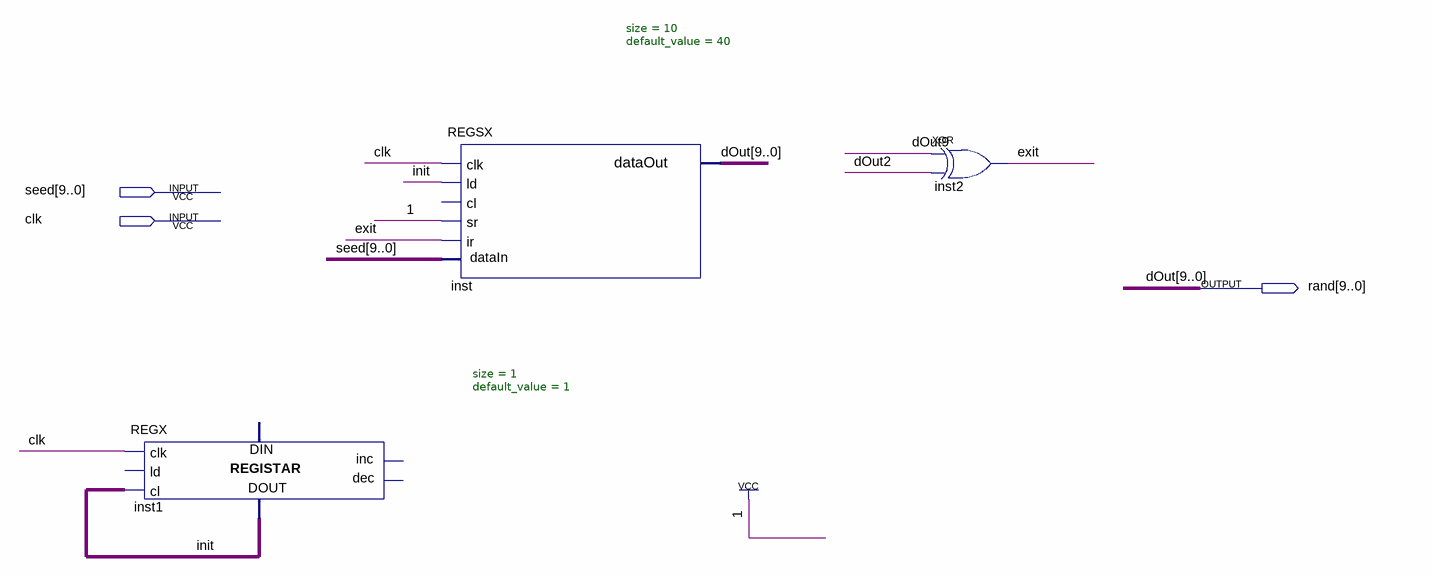
[diagram p0: schematic sheet]
// Quartus schematic randomNumberGenerator.bdf as structural Verilog: 3 symbols, 3 pins
module randomNumberGenerator (
  input  [9:0] seed,
  input  clk,
  output [9:0] \rand 
);

  wire exit, init;

  REGX #(.size(1), .default_value(1)) inst1 (.clk(clk), .cl(init), .data_out(init));  // open: ld, inc, dec, data_in
  REGSX #(.size(10), .default_value(40)) inst (
    .clk(clk), .ld(init), .sr(1'b1), .ir(exit), .data_in(seed), .data_out(\rand ));  // open: cl
  xor inst2 (exit, \rand [9], \rand [2]);

  // Other names for the same wires on the sheet: dOut[9:0] = \rand ; dOut2 = \rand [2]; dOut9 = \rand [9]
endmodule
